# Altium project PCB_15122020_01BC.PrjPcb (part 2 of 9)

## Sheet USB_To_RS232.SchDoc
size A3 portrait
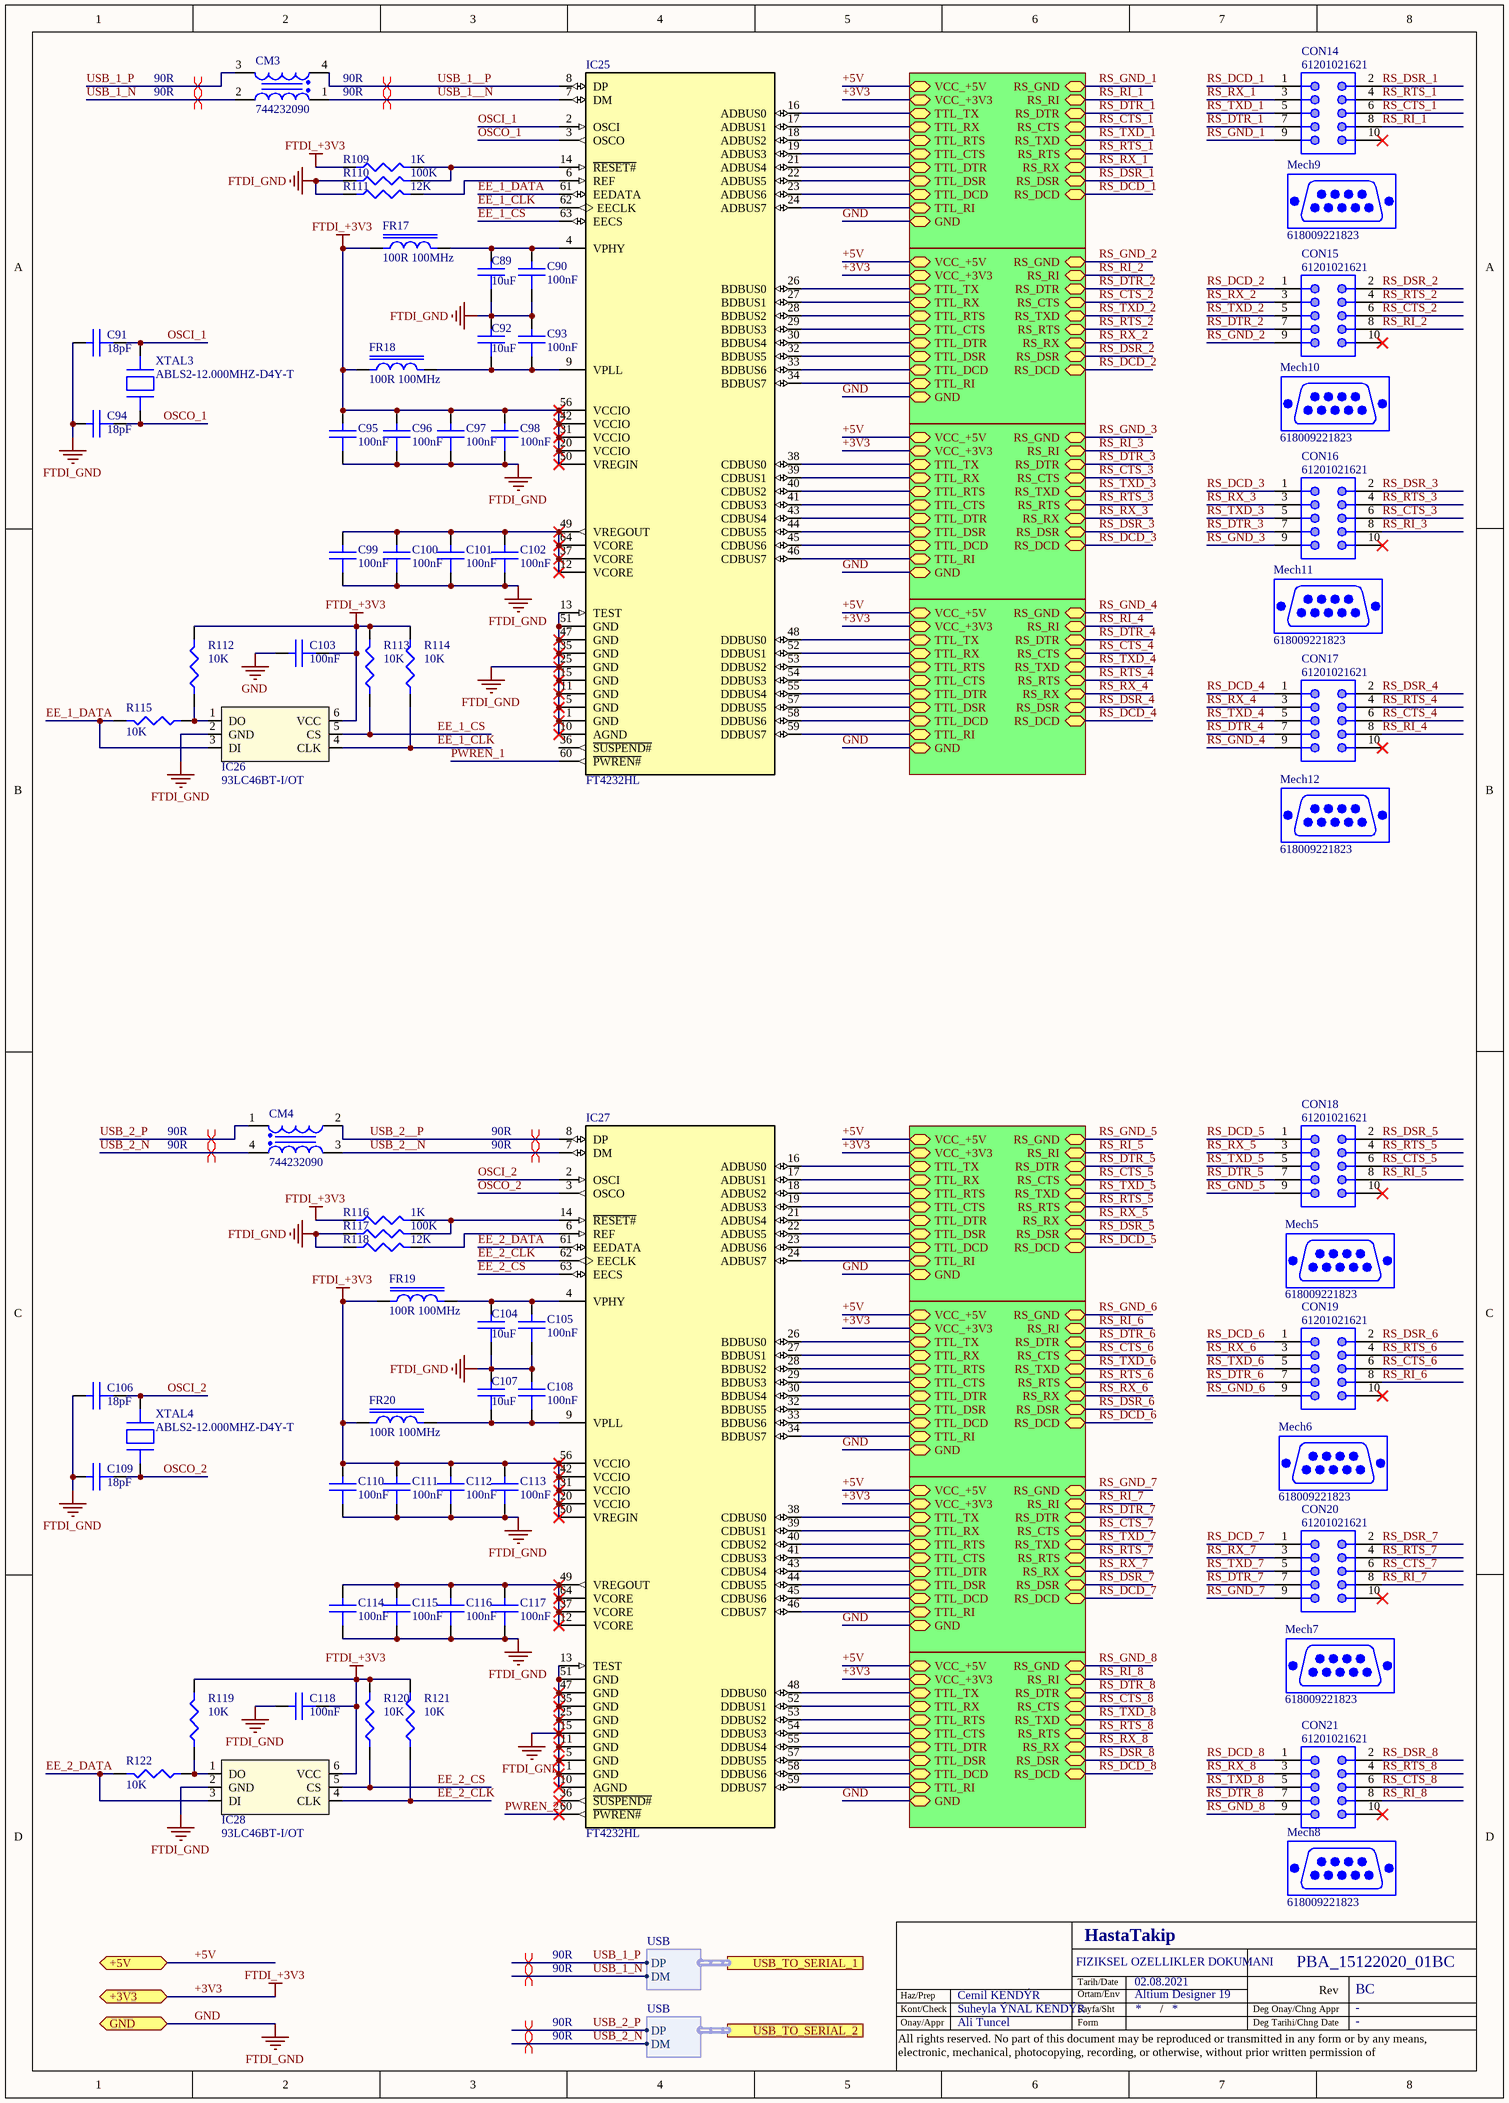
[diagram p1: USB_To_RS232.SchDoc]

### Parts
C89  10uF  [C0603]
C90  100nF  [C0603]
C91  18pF  [C0603]
C92  10uF  [C0603]
C93  100nF  [C0603]
C94  18pF  [C0603]
C95  100nF  [C0603]
C96  100nF  [C0603]
C97  100nF  [C0603]
C98  100nF  [C0603]
C99  100nF  [C0603]
C100  100nF  [C0603]
C101  100nF  [C0603]
C102  100nF  [C0603]
C103  100nF  [C0603]
C104  10uF  [C0603]
C105  100nF  [C0603]
C106  18pF  [C0603]
C107  10uF  [C0603]
C108  100nF  [C0603]
C109  18pF  [C0603]
C110  100nF  [C0603]
C111  100nF  [C0603]
C112  100nF  [C0603]
C113  100nF  [C0603]
C114  100nF  [C0603]
C115  100nF  [C0603]
C116  100nF  [C0603]
C117  100nF  [C0603]
C118  100nF  [C0603]
CM3  744232090  [WE-CNSW_1206]
CM4  744232090  [WE-CNSW_1206]
CON14  61201021621  [61201021621]
CON15  61201021621  [61201021621]
CON16  61201021621  [61201021621]
CON17  61201021621  [61201021621]
CON18  61201021621  [61201021621]
CON19  61201021621  [61201021621]
CON20  61201021621  [61201021621]
CON21  61201021621  [61201021621]
FR17  100R 100MHz  [FR_0603]
FR18  100R 100MHz  [FR_0603]
FR19  100R 100MHz  [FR_0603]
FR20  100R 100MHz  [FR_0603]
IC25  FT4232HL  [QFP50P1200X1200X160-64N]
IC26  93LC46BT-I/OT  [SOT 23-6]
IC27  FT4232HL  [QFP50P1200X1200X160-64N]
IC28  93LC46BT-I/OT  [SOT 23-6]
Mech5  618009221823  [618009221823]
Mech6  618009221823  [618009221823]
Mech7  618009221823  [618009221823]
Mech8  618009221823  [618009221823]
Mech9  618009221823  [618009221823]
Mech10  618009221823  [618009221823]
Mech11  618009221823  [618009221823]
Mech12  618009221823  [618009221823]
R109  1K  [R0603]
R110  100K  [R0603]
R111  12K  [R0603]
R112  10K  [R0603]
R113  10K  [R0603]
R114  10K  [R0603]
R115  10K  [R0603]
R116  1K  [R0603]
R117  100K  [R0603]
R118  12K  [R0603]
R119  10K  [R0603]
R120  10K  [R0603]
R121  10K  [R0603]
R122  10K  [R0603]
XTAL3  ABLS2-12.000MHZ-D4Y-T  [CrystalSMD]
XTAL4  ABLS2-12.000MHZ-D4Y-T  [CrystalSMD]

### Sub-sheets
RS232_1 = RS232.SchDoc: TTL_TX (bidir), TTL_RX (bidir), TTL_RTS (bidir), TTL_CTS (bidir), TTL_DTR (bidir), TTL_DSR (bidir), TTL_DCD (bidir), TTL_RI (bidir), RS_GND (bidir), RS_RI (bidir), RS_DTR (bidir), RS_CTS (bidir), RS_TXD (bidir), RS_RTS (bidir), RS_RX (bidir), RS_DSR (bidir), RS_DCD (bidir), VCC_+5V (bidir), GND (bidir), VCC_+3V3 (bidir)
RS232_2 = RS232.SchDoc: TTL_TX (bidir), TTL_RX (bidir), TTL_RTS (bidir), TTL_CTS (bidir), TTL_DTR (bidir), TTL_DSR (bidir), TTL_DCD (bidir), TTL_RI (bidir), RS_GND (bidir), RS_RI (bidir), RS_DTR (bidir), RS_CTS (bidir), RS_TXD (bidir), RS_RTS (bidir), RS_RX (bidir), RS_DSR (bidir), RS_DCD (bidir), VCC_+5V (bidir), GND (bidir), VCC_+3V3 (bidir)
RS232_3 = RS232.SchDoc: TTL_TX (bidir), TTL_RX (bidir), TTL_RTS (bidir), TTL_CTS (bidir), TTL_DTR (bidir), TTL_DSR (bidir), TTL_DCD (bidir), TTL_RI (bidir), RS_GND (bidir), RS_RI (bidir), RS_DTR (bidir), RS_CTS (bidir), RS_TXD (bidir), RS_RTS (bidir), RS_RX (bidir), RS_DSR (bidir), RS_DCD (bidir), VCC_+5V (bidir), GND (bidir), VCC_+3V3 (bidir)
RS232_4 = RS232.SchDoc: TTL_TX (bidir), TTL_RX (bidir), TTL_RTS (bidir), TTL_CTS (bidir), TTL_DTR (bidir), TTL_DSR (bidir), TTL_DCD (bidir), TTL_RI (bidir), RS_GND (bidir), RS_RI (bidir), RS_DTR (bidir), RS_CTS (bidir), RS_TXD (bidir), RS_RTS (bidir), RS_RX (bidir), RS_DSR (bidir), RS_DCD (bidir), VCC_+5V (bidir), GND (bidir), VCC_+3V3 (bidir)
RS232_5 = RS232.SchDoc: TTL_TX (bidir), TTL_RX (bidir), TTL_RTS (bidir), TTL_CTS (bidir), TTL_DTR (bidir), TTL_DSR (bidir), TTL_DCD (bidir), TTL_RI (bidir), RS_GND (bidir), RS_RI (bidir), RS_DTR (bidir), RS_CTS (bidir), RS_TXD (bidir), RS_RTS (bidir), RS_RX (bidir), RS_DSR (bidir), RS_DCD (bidir), VCC_+5V (bidir), GND (bidir), VCC_+3V3 (bidir)
RS232_6 = RS232.SchDoc: TTL_TX (bidir), TTL_RX (bidir), TTL_RTS (bidir), TTL_CTS (bidir), TTL_DTR (bidir), TTL_DSR (bidir), TTL_DCD (bidir), TTL_RI (bidir), RS_GND (bidir), RS_RI (bidir), RS_DTR (bidir), RS_CTS (bidir), RS_TXD (bidir), RS_RTS (bidir), RS_RX (bidir), RS_DSR (bidir), RS_DCD (bidir), VCC_+5V (bidir), GND (bidir), VCC_+3V3 (bidir)
RS232_7 = RS232.SchDoc: TTL_TX (bidir), TTL_RX (bidir), TTL_RTS (bidir), TTL_CTS (bidir), TTL_DTR (bidir), TTL_DSR (bidir), TTL_DCD (bidir), TTL_RI (bidir), RS_GND (bidir), RS_RI (bidir), RS_DTR (bidir), RS_CTS (bidir), RS_TXD (bidir), RS_RTS (bidir), RS_RX (bidir), RS_DSR (bidir), RS_DCD (bidir), VCC_+5V (bidir), GND (bidir), VCC_+3V3 (bidir)
RS232_8 = RS232.SchDoc: TTL_TX (bidir), TTL_RX (bidir), TTL_RTS (bidir), TTL_CTS (bidir), TTL_DTR (bidir), TTL_DSR (bidir), TTL_DCD (bidir), TTL_RI (bidir), RS_GND (bidir), RS_RI (bidir), RS_DTR (bidir), RS_CTS (bidir), RS_TXD (bidir), RS_RTS (bidir), RS_RX (bidir), RS_DSR (bidir), RS_DCD (bidir), VCC_+5V (bidir), GND (bidir), VCC_+3V3 (bidir)

### Ports
+3V3 (bidir), +5V (bidir), GND (bidir), USB_TO_SERIAL_1 (harness USB), USB_TO_SERIAL_2 (harness USB)

### Harnesses
USB: DP, DM

### Nets
+3V3: C95.1 C96.1 C97.1 C98.1 C103.2 C110.1 C111.1 C112.1 C113.1 C118.2 FR17.1 FR18.1 FR19.1 FR20.1 IC25.20(VCCIO) IC25.31(VCCIO) IC25.42(VCCIO) IC25.50(VREGIN) IC25.56(VCCIO) IC26.6(VCC) IC27.20(VCCIO) IC27.31(VCCIO) IC27.42(VCCIO) IC27.50(VREGIN) IC27.56(VCCIO) IC28.6(VCC) R109.1 R112.2 R113.2 R114.2 R116.1 R119.2 R120.2 R121.2 ; port +3V3, sheet RS232_1/VCC_+3V3, sheet RS232_2/VCC_+3V3, sheet RS232_3/VCC_+3V3, sheet RS232_4/VCC_+3V3, sheet RS232_5/VCC_+3V3, sheet RS232_6/VCC_+3V3, sheet RS232_7/VCC_+3V3, sheet RS232_8/VCC_+3V3  [also labelled FTDI_+3V3]
+5V: port +5V, sheet RS232_1/VCC_+5V, sheet RS232_2/VCC_+5V, sheet RS232_3/VCC_+5V, sheet RS232_4/VCC_+5V, sheet RS232_5/VCC_+5V, sheet RS232_6/VCC_+5V, sheet RS232_7/VCC_+5V, sheet RS232_8/VCC_+5V
GND: C89.2 C90.2 C91.1 C92.1 C93.1 C94.1 C95.2 C96.2 C97.2 C98.2 C99.2 C100.2 C101.2 C102.2 C103.1 C104.2 C105.2 C106.1 C107.1 C108.1 C109.1 C110.2 C111.2 C112.2 C113.2 C114.2 C115.2 C116.2 C117.2 C118.1 IC25.1(GND) IC25.5(GND) IC25.10(AGND) IC25.11(GND) IC25.13(TEST) IC25.15(GND) IC25.25(GND) IC25.35(GND) IC25.47(GND) IC25.51(GND) IC26.2(GND) IC27.1(GND) IC27.5(GND) IC27.10(AGND) IC27.11(GND) IC27.13(TEST) IC27.15(GND) IC27.25(GND) IC27.35(GND) IC27.47(GND) IC27.51(GND) IC28.2(GND) R110.1 R111.1 R117.1 R118.1 ; port GND, sheet RS232_1/GND, sheet RS232_2/GND, sheet RS232_3/GND, sheet RS232_4/GND, sheet RS232_5/GND, sheet RS232_6/GND, sheet RS232_7/GND, sheet RS232_8/GND  [also labelled FTDI_GND]
EE_1_CLK: IC25.62(EECLK) IC26.4(CLK) R114.1
EE_1_CS: IC25.63(EECS) IC26.5(CS) R113.1
EE_1_DATA: IC25.61(EEDATA) IC26.3(DI) R115.2
EE_2_CLK: IC27.62(EECLK) IC28.4(CLK) R121.1
EE_2_CS: IC27.63(EECS) IC28.5(CS) R120.1
EE_2_DATA: IC27.61(EEDATA) IC28.3(DI) R122.2
OSCI_1: C91.2 IC25.2(OSCI) XTAL3.2
OSCI_2: C106.2 IC27.2(OSCI) XTAL4.2
OSCO_1: C94.2 IC25.3(OSCO) XTAL3.1
OSCO_2: C109.2 IC27.3(OSCO) XTAL4.1
PWREN_1: IC25.60(~{PWREN#})
PWREN_2: IC27.60(~{PWREN#})
RS_CTS_1: CON14.6 ; sheet RS232_1/RS_CTS  [project net RS_CTS]
RS_CTS_2: CON15.6 ; sheet RS232_2/RS_CTS  [project net RS_CTS]
RS_CTS_3: CON16.6 ; sheet RS232_3/RS_CTS  [project net RS_CTS]
RS_CTS_4: CON17.6 ; sheet RS232_4/RS_CTS  [project net RS_CTS]
RS_CTS_5: CON18.6 ; sheet RS232_5/RS_CTS  [project net RS_CTS]
RS_CTS_6: CON19.6 ; sheet RS232_6/RS_CTS  [project net RS_CTS]
RS_CTS_7: CON20.6 ; sheet RS232_7/RS_CTS  [project net RS_CTS]
RS_CTS_8: CON21.6 ; sheet RS232_8/RS_CTS  [project net RS_CTS]
RS_DCD_1: CON14.1 ; sheet RS232_1/RS_DCD  [project net RS_DCD]
RS_DCD_2: CON15.1 ; sheet RS232_2/RS_DCD  [project net RS_DCD]
RS_DCD_3: CON16.1 ; sheet RS232_3/RS_DCD  [project net RS_DCD]
RS_DCD_4: CON17.1 ; sheet RS232_4/RS_DCD  [project net RS_DCD]
RS_DCD_5: CON18.1 ; sheet RS232_5/RS_DCD  [project net RS_DCD]
RS_DCD_6: CON19.1 ; sheet RS232_6/RS_DCD  [project net RS_DCD]
RS_DCD_7: CON20.1 ; sheet RS232_7/RS_DCD  [project net RS_DCD]
RS_DCD_8: CON21.1 ; sheet RS232_8/RS_DCD  [project net RS_DCD]
RS_DSR_1: CON14.2 ; sheet RS232_1/RS_DSR  [project net RS_DSR]
RS_DSR_2: CON15.2 ; sheet RS232_2/RS_DSR  [project net RS_DSR]
RS_DSR_3: CON16.2 ; sheet RS232_3/RS_DSR  [project net RS_DSR]
RS_DSR_4: CON17.2 ; sheet RS232_4/RS_DSR  [project net RS_DSR]
RS_DSR_5: CON18.2 ; sheet RS232_5/RS_DSR  [project net RS_DSR]
RS_DSR_6: CON19.2 ; sheet RS232_6/RS_DSR  [project net RS_DSR]
RS_DSR_7: CON20.2 ; sheet RS232_7/RS_DSR  [project net RS_DSR]
RS_DSR_8: CON21.2 ; sheet RS232_8/RS_DSR  [project net RS_DSR]
RS_DTR_1: CON14.7 ; sheet RS232_1/RS_DTR  [project net RS_DTR]
RS_DTR_2: CON15.7 ; sheet RS232_2/RS_DTR  [project net RS_DTR]
RS_DTR_3: CON16.7 ; sheet RS232_3/RS_DTR  [project net RS_DTR]
RS_DTR_4: CON17.7 ; sheet RS232_4/RS_DTR  [project net RS_DTR]
RS_DTR_5: CON18.7 ; sheet RS232_5/RS_DTR  [project net RS_DTR]
RS_DTR_6: CON19.7 ; sheet RS232_6/RS_DTR  [project net RS_DTR]
RS_DTR_7: CON20.7 ; sheet RS232_7/RS_DTR  [project net RS_DTR]
RS_DTR_8: CON21.7 ; sheet RS232_8/RS_DTR  [project net RS_DTR]
RS_GND_1: CON14.9 ; sheet RS232_1/RS_GND  [project net RS232_GND]
RS_GND_2: CON15.9 ; sheet RS232_2/RS_GND  [project net RS232_GND]
RS_GND_3: CON16.9 ; sheet RS232_3/RS_GND  [project net RS232_GND]
RS_GND_4: CON17.9 ; sheet RS232_4/RS_GND  [project net RS232_GND]
RS_GND_5: CON18.9 ; sheet RS232_5/RS_GND  [project net RS232_GND]
RS_GND_6: CON19.9 ; sheet RS232_6/RS_GND  [project net RS232_GND]
RS_GND_7: CON20.9 ; sheet RS232_7/RS_GND  [project net RS232_GND]
RS_GND_8: CON21.9 ; sheet RS232_8/RS_GND  [project net RS232_GND]
RS_RI_1: CON14.8 ; sheet RS232_1/RS_RI  [project net RS_RI]
RS_RI_2: CON15.8 ; sheet RS232_2/RS_RI  [project net RS_RI]
RS_RI_3: CON16.8 ; sheet RS232_3/RS_RI  [project net RS_RI]
RS_RI_4: CON17.8 ; sheet RS232_4/RS_RI  [project net RS_RI]
RS_RI_5: CON18.8 ; sheet RS232_5/RS_RI  [project net RS_RI]
RS_RI_6: CON19.8 ; sheet RS232_6/RS_RI  [project net RS_RI]
RS_RI_7: CON20.8 ; sheet RS232_7/RS_RI  [project net RS_RI]
RS_RI_8: CON21.8 ; sheet RS232_8/RS_RI  [project net RS_RI]
RS_RTS_1: CON14.4 ; sheet RS232_1/RS_RTS  [project net RS_RTS]
RS_RTS_2: CON15.4 ; sheet RS232_2/RS_RTS  [project net RS_RTS]
RS_RTS_3: CON16.4 ; sheet RS232_3/RS_RTS  [project net RS_RTS]
RS_RTS_4: CON17.4 ; sheet RS232_4/RS_RTS  [project net RS_RTS]
RS_RTS_5: CON18.4 ; sheet RS232_5/RS_RTS  [project net RS_RTS]
RS_RTS_6: CON19.4 ; sheet RS232_6/RS_RTS  [project net RS_RTS]
RS_RTS_7: CON20.4 ; sheet RS232_7/RS_RTS  [project net RS_RTS]
RS_RTS_8: CON21.4 ; sheet RS232_8/RS_RTS  [project net RS_RTS]
RS_RX_1: CON14.3 ; sheet RS232_1/RS_RX  [project net RS_RX]
RS_RX_2: CON15.3 ; sheet RS232_2/RS_RX  [project net RS_RX]
RS_RX_3: CON16.3 ; sheet RS232_3/RS_RX  [project net RS_RX]
RS_RX_4: CON17.3 ; sheet RS232_4/RS_RX  [project net RS_RX]
RS_RX_5: CON18.3 ; sheet RS232_5/RS_RX  [project net RS_RX]
RS_RX_6: CON19.3 ; sheet RS232_6/RS_RX  [project net RS_RX]
RS_RX_7: CON20.3 ; sheet RS232_7/RS_RX  [project net RS_RX]
RS_RX_8: CON21.3 ; sheet RS232_8/RS_RX  [project net RS_RX]
RS_TXD_1: CON14.5 ; sheet RS232_1/RS_TXD  [project net RS_TXD]
RS_TXD_2: CON15.5 ; sheet RS232_2/RS_TXD  [project net RS_TXD]
RS_TXD_3: CON16.5 ; sheet RS232_3/RS_TXD  [project net RS_TXD]
RS_TXD_4: CON17.5 ; sheet RS232_4/RS_TXD  [project net RS_TXD]
RS_TXD_5: CON18.5 ; sheet RS232_5/RS_TXD  [project net RS_TXD]
RS_TXD_6: CON19.5 ; sheet RS232_6/RS_TXD  [project net RS_TXD]
RS_TXD_7: CON20.5 ; sheet RS232_7/RS_TXD  [project net RS_TXD]
RS_TXD_8: CON21.5 ; sheet RS232_8/RS_TXD  [project net RS_TXD]
USB_1__N: CM3.1 IC25.7(DM)
USB_1__P: CM3.4 IC25.8(DP)
USB_1_N: CM3.2 ; port USB_TO_SERIAL_1.DM
USB_1_P: CM3.3 ; port USB_TO_SERIAL_1.DP
USB_2__N: CM4.3 IC27.7(DM)
USB_2__P: CM4.2 IC27.8(DP)
USB_2_N: CM4.4 ; port USB_TO_SERIAL_2.DM
USB_2_P: CM4.1 ; port USB_TO_SERIAL_2.DP
NetC89_1: C89.1 C90.1 FR17.2 IC25.4(VPHY)
NetC92_2: C92.2 C93.2 FR18.2 IC25.9(VPLL)
NetC99_1: C99.1 C100.1 C101.1 C102.1 IC25.12(VCORE) IC25.37(VCORE) IC25.49(VREGOUT) IC25.64(VCORE)
NetC104_1: C104.1 C105.1 FR19.2 IC27.4(VPHY)
NetC107_2: C107.2 C108.2 FR20.2 IC27.9(VPLL)
NetC114_1: C114.1 C115.1 C116.1 C117.1 IC27.12(VCORE) IC27.37(VCORE) IC27.49(VREGOUT) IC27.64(VCORE)
NetIC25_6: IC25.6(REF) R111.2
NetIC25_14: IC25.14(~{RESET#}) R109.2 R110.2
NetIC25_16: IC25.16(ADBUS0) ; sheet RS232_1/TTL_TX
NetIC25_17: IC25.17(ADBUS1) ; sheet RS232_1/TTL_RX
NetIC25_18: IC25.18(ADBUS2) ; sheet RS232_1/TTL_RTS
NetIC25_19: IC25.19(ADBUS3) ; sheet RS232_1/TTL_CTS
NetIC25_21: IC25.21(ADBUS4) ; sheet RS232_1/TTL_DTR
NetIC25_22: IC25.22(ADBUS5) ; sheet RS232_1/TTL_DSR
NetIC25_23: IC25.23(ADBUS6) ; sheet RS232_1/TTL_DCD
NetIC25_24: IC25.24(ADBUS7) ; sheet RS232_1/TTL_RI
NetIC25_26: IC25.26(BDBUS0) ; sheet RS232_2/TTL_TX
NetIC25_27: IC25.27(BDBUS1) ; sheet RS232_2/TTL_RX
NetIC25_28: IC25.28(BDBUS2) ; sheet RS232_2/TTL_RTS
NetIC25_29: IC25.29(BDBUS3) ; sheet RS232_2/TTL_CTS
NetIC25_30: IC25.30(BDBUS4) ; sheet RS232_2/TTL_DTR
NetIC25_32: IC25.32(BDBUS5) ; sheet RS232_2/TTL_DSR
NetIC25_33: IC25.33(BDBUS6) ; sheet RS232_2/TTL_DCD
NetIC25_34: IC25.34(BDBUS7) ; sheet RS232_2/TTL_RI
NetIC25_38: IC25.38(CDBUS0) ; sheet RS232_3/TTL_TX
NetIC25_39: IC25.39(CDBUS1) ; sheet RS232_3/TTL_RX
NetIC25_40: IC25.40(CDBUS2) ; sheet RS232_3/TTL_RTS
NetIC25_41: IC25.41(CDBUS3) ; sheet RS232_3/TTL_CTS
NetIC25_43: IC25.43(CDBUS4) ; sheet RS232_3/TTL_DTR
NetIC25_44: IC25.44(CDBUS5) ; sheet RS232_3/TTL_DSR
NetIC25_45: IC25.45(CDBUS6) ; sheet RS232_3/TTL_DCD
NetIC25_46: IC25.46(CDBUS7) ; sheet RS232_3/TTL_RI
NetIC25_48: IC25.48(DDBUS0) ; sheet RS232_4/TTL_TX
NetIC25_52: IC25.52(DDBUS1) ; sheet RS232_4/TTL_RX
NetIC25_53: IC25.53(DDBUS2) ; sheet RS232_4/TTL_RTS
NetIC25_54: IC25.54(DDBUS3) ; sheet RS232_4/TTL_CTS
NetIC25_55: IC25.55(DDBUS4) ; sheet RS232_4/TTL_DTR
NetIC25_57: IC25.57(DDBUS5) ; sheet RS232_4/TTL_DSR
NetIC25_58: IC25.58(DDBUS6) ; sheet RS232_4/TTL_DCD
NetIC25_59: IC25.59(DDBUS7) ; sheet RS232_4/TTL_RI
NetIC26_1: IC26.1(DO) R112.1 R115.1
NetIC27_6: IC27.6(REF) R118.2
NetIC27_14: IC27.14(~{RESET#}) R116.2 R117.2
NetIC27_16: IC27.16(ADBUS0) ; sheet RS232_5/TTL_TX
NetIC27_17: IC27.17(ADBUS1) ; sheet RS232_5/TTL_RX
NetIC27_18: IC27.18(ADBUS2) ; sheet RS232_5/TTL_RTS
NetIC27_19: IC27.19(ADBUS3) ; sheet RS232_5/TTL_CTS
NetIC27_21: IC27.21(ADBUS4) ; sheet RS232_5/TTL_DTR
NetIC27_22: IC27.22(ADBUS5) ; sheet RS232_5/TTL_DSR
NetIC27_23: IC27.23(ADBUS6) ; sheet RS232_5/TTL_DCD
NetIC27_24: IC27.24(ADBUS7) ; sheet RS232_5/TTL_RI
NetIC27_26: IC27.26(BDBUS0) ; sheet RS232_6/TTL_TX
NetIC27_27: IC27.27(BDBUS1) ; sheet RS232_6/TTL_RX
NetIC27_28: IC27.28(BDBUS2) ; sheet RS232_6/TTL_RTS
NetIC27_29: IC27.29(BDBUS3) ; sheet RS232_6/TTL_CTS
NetIC27_30: IC27.30(BDBUS4) ; sheet RS232_6/TTL_DTR
NetIC27_32: IC27.32(BDBUS5) ; sheet RS232_6/TTL_DSR
NetIC27_33: IC27.33(BDBUS6) ; sheet RS232_6/TTL_DCD
NetIC27_34: IC27.34(BDBUS7) ; sheet RS232_6/TTL_RI
NetIC27_38: IC27.38(CDBUS0) ; sheet RS232_7/TTL_TX
NetIC27_39: IC27.39(CDBUS1) ; sheet RS232_7/TTL_RX
NetIC27_40: IC27.40(CDBUS2) ; sheet RS232_7/TTL_RTS
NetIC27_41: IC27.41(CDBUS3) ; sheet RS232_7/TTL_CTS
NetIC27_43: IC27.43(CDBUS4) ; sheet RS232_7/TTL_DTR
NetIC27_44: IC27.44(CDBUS5) ; sheet RS232_7/TTL_DSR
NetIC27_45: IC27.45(CDBUS6) ; sheet RS232_7/TTL_DCD
NetIC27_46: IC27.46(CDBUS7) ; sheet RS232_7/TTL_RI
NetIC27_48: IC27.48(DDBUS0) ; sheet RS232_8/TTL_TX
NetIC27_52: IC27.52(DDBUS1) ; sheet RS232_8/TTL_RX
NetIC27_53: IC27.53(DDBUS2) ; sheet RS232_8/TTL_RTS
NetIC27_54: IC27.54(DDBUS3) ; sheet RS232_8/TTL_CTS
NetIC27_55: IC27.55(DDBUS4) ; sheet RS232_8/TTL_DTR
NetIC27_57: IC27.57(DDBUS5) ; sheet RS232_8/TTL_DSR
NetIC27_58: IC27.58(DDBUS6) ; sheet RS232_8/TTL_DCD
NetIC27_59: IC27.59(DDBUS7) ; sheet RS232_8/TTL_RI
NetIC28_1: IC28.1(DO) R119.1 R122.1

Not connected (* = marked no-connect by the designer): CON14 10*; CON15 10*; CON16 10*; CON17 10*; CON18 10*; CON19 10*; CON20 10*; CON21 10*; IC25 36(~{SUSPEND#}); IC27 36(~{SUSPEND#})*

### Layout directives
differential pair; differential pair class 90R: USB_1__N, USB_1__P, USB_1_N, USB_1_P, USB_2__N, USB_2__P, USB_2_N, USB_2_P

### Notes on the sheet
- Tarih/Date
- Haz/Prep
- Kont/Check
- Onay/Appr
- Sayfa/Sht
- Form
- Ortam/Env
- /
- Deg Tarihi/Chng Date
- Deg Onay/Chng Appr
- Rev
- All rights reserved. No part of this document may be reproduced or transmitted in any form or by any means, electronic, mechanical, photocopying, recording, or otherwise, without prior written permission of

### Library data of the parts
C89 C92 C104 C107 = CC0603MRX5R6BB106: 10uF 10V X5R 20% SMD 0603 85C Paper T/R; Manufacturer: Yageo; Supplier 1: Digi-Key; Supplier Part Number 1: 311-1817-1-ND; Manufacturer Part Number: CC0603MRX5R6BB106; Stock 1: 209492; Pricing 1: 1 = 0,20000, 10 = 0,13700, 50 = 0,08200, 100 = 0,06920, 500 = 0,04736, 1000 = 0,04190 (USD); RoHS: Yes; Mount: Surface Mount; Case/Package: 0603; Case Code (Imperial): 0603; Case Code (Metric): 1608; Weight: 7.1E-05oz; Min Operating Temperature: -55°C; Max Operating Temperature: 85°C; Voltage Rating: 10V; Termination: SMD/SMT; Resistor Type: Ceramic; Dielectric: X5R; Tolerance: 20%; Packaging: Tape and Reel; Capacitance: 10uF; Voltage Rating (DC): 10V; Length: 0.063inch; Width: 0.031inch; Thickness: 0.035inch; Depth: 0.8mm; Lead Free: Lead Free; Halogen Free: Halogen Free; ComponentLink1URL: http://components.arrow.com/part/dataview/0323_03079270?src-supplier=Arrow+Europe; ComponentLink1Description: http://components.arrow.com/part/dataview/0323_03079270?src-supplier=Arrow+Europe; ComponentLink2URL: http://www.mouser.com/ds/2/447/UPY-GPHC_X5R_4V-to-50V_25-1131599.pdf?src-supplier=Mouser; ComponentLink2Description: http://www.mouser.com/ds/2/447/UPY-GPHC_X5R_4V-to-50V_25-1131599.pdf?src-supplier=Mouser; ComponentLink3URL: http://www.yageo.com/documents/recent/UPY-GPHC_X5R_4V-to-50V_25.pdf?src-supplier=Digi-Key; ComponentLink3Description: http://www.yageo.com/documents/recent/UPY-GPHC_X5R_4V-to-50V_25.pdf?src-supplier=Digi-Key; Category: Capasitor
C90 C93 C95-C103 C105 C108 C110-C118 = CC0603KRX7R8BB104: 100nF, 25V, X7R, 10%, 0603; Manufacturer: Yageo; Supplier 1: Digi-Key; Supplier Part Number 1: 311-1341-1-ND; Manufacturer Part Number: CC0603KRX7R8BB104; Stock 1: 10150433; Pricing 1: 1 = 0,10000, 10 = 0,04500, 50 = 0,02480, 100 = 0,02020, 500 = 0,01444, 1000 = 0,01134 (USD); RoHS: Yes; Mount: Surface Mount; Case/Package: 0603; Number of Pins: 2; Case Code (Imperial): 0603; Case Code (Metric): 1608; Min Operating Temperature: -55°C; Max Operating Temperature: 125°C; Capacitance: 100nF; Tolerance: 10%; Voltage Rating: 25V; Packaging: Tape and Reel; Package Quantity: 1; Voltage Rating (DC): 25V; Dielectric: X7R; Termination: SMD/SMT; Resistor Type: Ceramic; Voltage: 25V; Length: 1.6mm; Width: 0.8mm; Height: 0.8mm; Thickness: 0.035inch; Depth: 0.8mm; Radiation Hardening: No; REACH SVHC: Unknown; Lead Free: Lead Free; Halogen Free: Halogen Free; ComponentLink1URL: https://datasheet.ciiva.com/11786/0900766b80c10176-11786120.pdf?src-supplier=RSComponents; ComponentLink1Description: https://datasheet.ciiva.com/11786/0900766b80c10176-11786120.pdf?src-supplier=RSComponents; ComponentLink2URL: https://datasheet.ciiva.com/144/mlccorderingcode-144075.pdf?src-supplier=Digi-Key; ComponentLink2Description: https://datasheet.ciiva.com/144/mlccorderingcode-144075.pdf?src-supplier=Digi-Key; ComponentLink3URL: https://datasheet.ciiva.com/17434/upy-gphc-x7r-6-3v-to-50v-8-17434263.pdf?src-supplier=Avnet+Europe; ComponentLink3Description: https://datasheet.ciiva.com/17434/upy-gphc-x7r-6-3v-to-50v-8-17434263.pdf?src-supplier=Avnet+Europe; ComponentLink4URL: https://datasheet.ciiva.com/26829/getdatasheetpartid-403577-26829431.pdf?src-supplier=Verical; ComponentLink4Description: https://datasheet.ciiva.com/26829/getdatasheetpartid-403577-26829431.pdf?src-supplier=Verical; ComponentLink5URL: https://datasheet.ciiva.com/11587/upy-gphc-x7r-6-3v-to-50v-8-11587208.pdf?src-supplier=Avnet; ComponentLink5Description: https://datasheet.ciiva.com/11587/upy-gphc-x7r-6-3v-to-50v-8-11587208.pdf?src-supplier=Avnet; ComponentLink6URL: https://datasheet.ciiva.com/13389/upy-gphc-x7r-6-3v-to-50v-8-13389352.pdf?src-supplier=Mouser; ComponentLink6Description: https://datasheet.ciiva.com/13389/upy-gphc-x7r-6-3v-to-50v-8-13389352.pdf?src-supplier=Mouser; ComponentLink7URL: https://datasheet.ciiva.com/28450/1489800-28450584.pdf?src-supplier=Element14; ComponentLink7Description: https://datasheet.ciiva.com/28450/1489800-28450584.pdf?src-supplier=Element14; ComponentLink8URL: https://datasheet.ciiva.com/144/mlccorderingcode-144073.pdf?src-supplier=Digi-Key; ComponentLink8Description: https://datasheet.ciiva.com/144/mlccorderingcode-144073.pdf?src-supplier=Digi-Key; ComponentLink9URL: https://datasheet.ciiva.com/144/mlccorderingcode-144074.pdf?src-supplier=Digi-Key; ComponentLink9Description: https://datasheet.ciiva.com/144/mlccorderingcode-144074.pdf?src-supplier=Digi-Key; ComponentLink10URL: https://datasheet.ciiva.com/7978/1489800-7978155.pdf?src-supplier=Element14; ComponentLink10Description: https://datasheet.ciiva.com/7978/1489800-7978155.pdf?src-supplier=Element14; Category: Capasitor
C91 C94 C106 C109 = CC0603JRNPO9BN180: 18 pF, 50 V, 0603 ± 5%, C0G / NP0; Manufacturer: Yageo; Voltage Rating: 50V; Temperature Coefficient: 30ppm/°C; Insulation Resistance: 100GR; Supplier 1: Digi-Key; Supplier Part Number 1: 311-1061-1-ND; Manufacturer Part Number: CC0603JRNPO9BN180; Stock 1: 27569; Pricing 1: 1 = 0,10000, 10 = 0,04100, 50 = 0,02220, 100 = 0,01810, 500 = 0,01294, 1000 = 0,01016 (USD); RoHS: Yes; Mount: Surface Mount; Case/Package: 0603; Number of Pins: 2; Case Code (Metric): 1608; Case Code (Imperial): 0603; Min Operating Temperature: -55°C; Max Operating Temperature: 125°C; Capacitance: 18pF; Tolerance: 5%; Packaging: Tape and Reel; Voltage Rating (DC): 50V; Package Quantity: 1; Dielectric: C0G; Termination: SMD/SMT; Resistor Type: Ceramic; Length: 1.6mm; Width: 0.031inch; Height: 0.8mm; Thickness: 0.035inch; Depth: 0.8mm; Radiation Hardening: No; REACH SVHC: No SVHC; Lead Free: Lead Free; ComponentLink1URL: https://datasheet.ciiva.com/144/mlccorderingcode-144637.pdf?src-supplier=Digi-Key; ComponentLink1Description: https://datasheet.ciiva.com/144/mlccorderingcode-144637.pdf?src-supplier=Digi-Key; ComponentLink2URL: https://datasheet.ciiva.com/144/mlccorderingcode-144638.pdf?src-supplier=Digi-Key; ComponentLink2Description: https://datasheet.ciiva.com/144/mlccorderingcode-144638.pdf?src-supplier=Digi-Key; ComponentLink3URL: https://datasheet.ciiva.com/144/mlccorderingcode-144639.pdf?src-supplier=Digi-Key; ComponentLink3Description: https://datasheet.ciiva.com/144/mlccorderingcode-144639.pdf?src-supplier=Digi-Key; ComponentLink4URL: https://datasheet.ciiva.com/8033/1734582-8033733.pdf?src-supplier=Element14; ComponentLink4Description: https://datasheet.ciiva.com/8033/1734582-8033733.pdf?src-supplier=Element14; ComponentLink5URL: https://datasheet.ciiva.com/46430/1835847-46430152.pdf?src-supplier=Element14; ComponentLink5Description: https://datasheet.ciiva.com/46430/1835847-46430152.pdf?src-supplier=Element14; ComponentLink6URL: https://datasheet.ciiva.com/11587/upy-gp-np0-16v-to-50v-8-11587323.pdf?src-supplier=Avnet; ComponentLink6Description: https://datasheet.ciiva.com/11587/upy-gp-np0-16v-to-50v-8-11587323.pdf?src-supplier=Avnet; ComponentLink7URL: https://datasheet.ciiva.com/16625/upy-gp-np0-16v-to-50v-8-16625517.pdf?src-supplier=Avnet+Europe; ComponentLink7Description: https://datasheet.ciiva.com/16625/upy-gp-np0-16v-to-50v-8-16625517.pdf?src-supplier=Avnet+Europe; ComponentLink8URL: https://datasheet.ciiva.com/28450/1443161-28450477.pdf?src-supplier=Element14; ComponentLink8Description: https://datasheet.ciiva.com/28450/1443161-28450477.pdf?src-supplier=Element14; ComponentLink9URL: https://datasheet.ciiva.com/5425/upy-gp-np0-16v-to-50v-8-5425439.pdf?src-supplier=Mouser; ComponentLink9Description: https://datasheet.ciiva.com/5425/upy-gp-np0-16v-to-50v-8-5425439.pdf?src-supplier=Mouser; Category: Capasitor
CM3 CM4 = 744232090: Common Mode Chokes Dual 90Ohm 100MHz 370mA SMD T/R; Manufacturer: Wurth Electronics; Core Material: Ferrite; Number of Lines: 2; Tolerance: 25%; Voltage Rating: 50V; Resistance: 300mR; Inductance: 3.3H; Impedance: 90R; Supplier 1: Digi-Key; Supplier Part Number 1: 732-1469-1-ND; Manufacturer Part Number: 744232090; Stock 1: 24452; Pricing 1: 1 = 1,23000, 10 = 1,17600, 50 = 1,09800, 100 = 1,03900, 500 = 1,00000, 1000 = 0,82300 (USD); RoHS: Yes; Mount: Surface Mount; Case/Package: 1206; Weight: 0.001376oz; Min Operating Temperature: -40°C; Max Operating Temperature: 125°C; Package Quantity: 1; Packaging: Tape and Reel; Frequency: 100MHz; Current Rating: 370mA; Voltage Rating (DC): 50V; Max Current Rating: 370mA; Current: 370mA; DC Resistance (DCR): 300mR; Max DC Current: 370mA; Termination: SMD/SMT; Test Frequency: 100MHz; Length: 3.2mm; Width: 1.6mm; Height: 0.083inch; Depth: 1.6mm; REACH SVHC: No SVHC; Lead Free: Lead Free; ComponentLink1URL: https://datasheet.ciiva.com/1008/744232090-1008352.pdf?src-supplier=Digi-Key; ComponentLink1Description: https://datasheet.ciiva.com/1008/744232090-1008352.pdf?src-supplier=Digi-Key; ComponentLink2URL: https://datasheet.ciiva.com/4952/744232090-24424-4952291.pdf?src-supplier=Mouser; ComponentLink2Description: https://datasheet.ciiva.com/4952/744232090-24424-4952291.pdf?src-supplier=Mouser; ComponentLink3URL: https://datasheet.ciiva.com/1467/1735620-1467976.pdf?src-supplier=Element14; ComponentLink3Description: https://datasheet.ciiva.com/1467/1735620-1467976.pdf?src-supplier=Element14; ComponentLink4URL: https://datasheet.ciiva.com/11800/0900766b80595ce5-11800284.pdf?src-supplier=RSComponents; ComponentLink4Description: https://datasheet.ciiva.com/11800/0900766b80595ce5-11800284.pdf?src-supplier=RSComponents; ComponentLink5URL: https://datasheet.ciiva.com/14187/744232090-eng-tds-14187245.pdf?src-supplier=Distrelec; ComponentLink5Description: https://datasheet.ciiva.com/14187/744232090-eng-tds-14187245.pdf?src-supplier=Distrelec; Category: Filters Common Mode Chokes
CON14-CON21 = 61201021621: WURTH ELEKTRONIK - 61201021621 - Pin Header, Wire-to-Board, 2.54 mm, 2 Rows, 10 Contacts, Through Hole Straight, WR-BHD Series; Manufacturer: Wurth Electronics; Current Rating: 3A; Voltage Rating: 250V; Number of Positions: 10; Insulation Resistance: 1GR; Gender: Male; Connector Type: Male Pin; Pitch: 2.54mm; Row Spacing: 0.1inch; Supplier 1: Digi-Key; Supplier Part Number 1: 732-2094-ND; Manufacturer Part Number: 61201021621; Stock 1: 15759; Pricing 1: 1 = 0,45000, 10 = 0,43700, 50 = 0,40300, 100 = 0,36100, 260 = 0,31900, 520 = 0,31100 (USD); RoHS: Yes; Mount: Through Hole; Color: Black; Contact Material: Copper Alloy,Copper; Contact Plating: Gold; Housing Material: PBT; Min Operating Temperature: -40°C; Max Operating Temperature: 125°C; Package Quantity: 260; Number of Rows: 2; Packaging: Tray; Contact Gender: Male; Termination: Solder; Number of Contacts: 10; Orientation: Straight; Length: 9.1mm; Width: 20.36mm; Height: 8.85mm; REACH SVHC: Unknown; Lead Free: Lead Free; Flammability Rating: UL94 V-0; ComponentLink1URL: https://datasheet.ciiva.com/731/6120xx21621-731344.pdf?src-supplier=Digi-Key; ComponentLink1Description: https://datasheet.ciiva.com/731/6120xx21621-731344.pdf?src-supplier=Digi-Key; ComponentLink2URL: https://datasheet.ciiva.com/15395/6120xx21621-265834-15395106.pdf?src-supplier=Mouser; ComponentLink2Description: https://datasheet.ciiva.com/15395/6120xx21621-265834-15395106.pdf?src-supplier=Mouser; ComponentLink3URL: https://datasheet.ciiva.com/7648/76595-7648121.pdf?src-supplier=Element14; ComponentLink3Description: https://datasheet.ciiva.com/7648/76595-7648121.pdf?src-supplier=Element14; Category: Connectors, Interconnects Rectangular Connectors - Headers, Male Pins
FR17-FR20 = 742792620: 100Ohm 100MHz 500mA 0603 SMD; Manufacturer: Wurth Electronics; Tolerance: 25%; Resistance: 150mR; Number of Lines: 1; Supplier 1: Digi-Key; Supplier Part Number 1: 732-1579-1-ND; Manufacturer Part Number: 742792620; Stock 1: 4265; Pricing 1: 1 = 0,14000, 50 = 0,14000, 100 = 0,12900, 500 = 0,12300, 1000 = 0,11800, 2000 = 0,11200 (USD); RoHS: Yes; Mount: Surface Mount; Case/Package: SMD/SMT; Number of Pins: 2; Weight: 0.000141oz; Case Code (Metric): 1608; Case Code (Imperial): 0603; Material: Ferrite; Min Operating Temperature: -55°C; Max Operating Temperature: 125°C; Package Quantity: 1; Current Rating: 500mA; Packaging: Tape and Reel; Impedance: 100R; Max Current Rating: 500mA; DC Resistance (DCR): 150mR; Max DC Current: 500mA; Termination: SMD/SMT; Test Frequency: 100MHz; Length: 1.6mm; Width: 0.8mm; Height: 0.8mm; Depth: 0.8mm; REACH SVHC: Unknown; Lead Free: Lead Free; ComponentLink1URL: https://datasheet.ciiva.com/1013/742792620-1013392.pdf?src-supplier=Digi-Key; ComponentLink1Description: https://datasheet.ciiva.com/1013/742792620-1013392.pdf?src-supplier=Digi-Key; ComponentLink2URL: https://datasheet.ciiva.com/30489/0900766b812a674b-30489152.pdf?src-supplier=RSComponents; ComponentLink2Description: https://datasheet.ciiva.com/30489/0900766b812a674b-30489152.pdf?src-supplier=RSComponents; ComponentLink3URL: https://datasheet.ciiva.com/23762/742792620-23762994.pdf?src-supplier=Newark; ComponentLink3Description: https://datasheet.ciiva.com/23762/742792620-23762994.pdf?src-supplier=Newark; ComponentLink4URL: https://datasheet.ciiva.com/22711/530503-22711411.pdf?src-supplier=Element14; ComponentLink4Description: https://datasheet.ciiva.com/22711/530503-22711411.pdf?src-supplier=Element14; ComponentLink5URL: https://datasheet.ciiva.com/4940/742792620-81075-4940413.pdf?src-supplier=Mouser; ComponentLink5Description: https://datasheet.ciiva.com/4940/742792620-81075-4940413.pdf?src-supplier=Mouser; ComponentLink6URL: https://datasheet.ciiva.com/1013/742792620-1013393.pdf?src-supplier=Digi-Key; ComponentLink6Description: https://datasheet.ciiva.com/1013/742792620-1013393.pdf?src-supplier=Digi-Key; ComponentLink7URL: https://datasheet.ciiva.com/1013/742792620-1013394.pdf?src-supplier=Digi-Key; ComponentLink7Description: https://datasheet.ciiva.com/1013/742792620-1013394.pdf?src-supplier=Digi-Key; ComponentLink8URL: https://datasheet.ciiva.com/1466/530503-1466423.pdf?src-supplier=Element14; ComponentLink8Description: https://datasheet.ciiva.com/1466/530503-1466423.pdf?src-supplier=Element14; ComponentLink9URL: https://datasheet.ciiva.com/48698/001087044-da-01-ml-we-cbf-smd-ferrit-742792620-de-en-48698348.pdf?src-supplier=Conrad; ComponentLink9Description: https://datasheet.ciiva.com/48698/001087044-da-01-ml-we-cbf-smd-ferrit-742792620-de-en-48698348.pdf?src-supplier=Conrad; Category: Filters - Ferrite Beads and Chips
IC25 IC27 = FT4232HL-TRAY: IC USB HS QUAD UART/SYNC 64-LQFP; Manufacturer: FTDI; Number of Channels: 1; Max Supply Voltage: 3.63V; Min Supply Voltage: 1.62V; Interface: UART; Operating Supply Current: 70mA; Operating Supply Voltage: 3.3V; Supplier 1: Digi-Key; Manufacturer Part Number: FT4232HL-TRAY; Stock 1: 1575; Pricing 1: 1 = 8,30000, 10 = 8,09000, 50 = 7,46000, 100 = 7,14000, 500 = 6,88002, 1000 = 6,08000, 2500 = 5,28299 (USD); RoHS: Yes; Mount: Surface Mount; Case/Package: LQFP; Number of Pins: 64; Min Operating Temperature: -40°C; Max Operating Temperature: 85°C; Packaging: Tray; Package Quantity: 160; Radiation Hardening: No; ComponentLink1URL: https://datasheet.ciiva.com/26852/getdatasheetpartid-653404-26852859.pdf?src-supplier=Verical; ComponentLink1Description: https://datasheet.ciiva.com/26852/getdatasheetpartid-653404-26852859.pdf?src-supplier=Verical; ComponentLink2URL: https://datasheet.ciiva.com/26841/ft4232hl-tray-26841239.pdf?src-supplier=IIIC; ComponentLink2Description: https://datasheet.ciiva.com/26841/ft4232hl-tray-26841239.pdf?src-supplier=IIIC; ComponentLink3URL: https://datasheet.ciiva.com/1787/ds-ft4232h-1787139.pdf?src-supplier=Digi-Key; ComponentLink3Description: https://datasheet.ciiva.com/1787/ds-ft4232h-1787139.pdf?src-supplier=Digi-Key; Supplier Part Number 1: 768-1309-ND; Category: Integrated Circuits - Interface - Controllers
IC26 IC28 = 93LC46BT-I/OT: MICROCHIP - 93LC46BT-I/OT - EEPROM, Microwire, 1 Kbit, 64 x 16bit, Serial Microwire, 3 MHz, SOT-23, 6 Pins; Density: 1Kb; Max Supply Voltage: 5.5V; Min Supply Voltage: 2.5V; Access Time: 250ns; Frequency: 2MHz; Nominal Supply Current: 2mA; Supplier 1: Digi-Key; Supplier Part Number 1: 93LC46BT-I/OTCT-ND; Manufacturer: Microchip; Manufacturer Part Number: 93LC46BT-I/OT; Stock 1: 3299; Pricing 1: 1 = 0,20000, 100 = 0,19000 (USD); RoHS: Yes; Mount: Surface Mount; Case/Package: SOT-23; Number of Pins: 6; Contact Plating: Tin,Matte; Min Operating Temperature: -40°C; Max Operating Temperature: 85°C; Packaging: Tape and Reel; Package Quantity: 3000; Interface: Serial; Memory Type: EEPROM; Memory Size: 1Kb; Termination: SMD/SMT; Max Frequency: 2MHz; Length: 3.1mm; Width: 1.8mm; Height: 1.3mm; Radiation Hardening: No; REACH SVHC: No SVHC; Lead Free: Lead Free; ComponentLink1URL: https://datasheet.ciiva.com/1903/21749j-1903248.pdf?src-supplier=Digi-Key; ComponentLink1Description: https://datasheet.ciiva.com/1903/21749j-1903248.pdf?src-supplier=Digi-Key; ComponentLink2URL: https://datasheet.ciiva.com/41455/001085450-da-01-en-ic-eeprom-1kb-93lc46bt-i-ot-sot-23-6-mcp-41455225.pdf?src-supplier=Conrad; ComponentLink2Description: https://datasheet.ciiva.com/41455/001085450-da-01-en-ic-eeprom-1kb-93lc46bt-i-ot-sot-23-6-mcp-41455225.pdf?src-supplier=Conrad; ComponentLink3URL: https://datasheet.ciiva.com/1155/1688094-1155913.pdf?src-supplier=Element14; ComponentLink3Description: https://datasheet.ciiva.com/1155/1688094-1155913.pdf?src-supplier=Element14; ComponentLink4URL: https://datasheet.ciiva.com/22715/664718-22715194.pdf?src-supplier=Element14; ComponentLink4Description: https://datasheet.ciiva.com/22715/664718-22715194.pdf?src-supplier=Element14; ComponentLink5URL: https://datasheet.ciiva.com/9280/21749j-9280764.pdf?src-supplier=Avnet; ComponentLink5Description: https://datasheet.ciiva.com/9280/21749j-9280764.pdf?src-supplier=Avnet; ComponentLink6URL: https://datasheet.ciiva.com/14134/93lc46-abc-eng-tds-14134797.pdf?src-supplier=Distrelec; ComponentLink6Description: https://datasheet.ciiva.com/14134/93lc46-abc-eng-tds-14134797.pdf?src-supplier=Distrelec; ComponentLink7URL: https://datasheet.ciiva.com/16387/filehandler-aspxddocname-en550232-16387837.pdf?src-supplier=Future+Electronics; ComponentLink7Description: https://datasheet.ciiva.com/16387/filehandler-aspxddocname-en550232-16387837.pdf?src-supplier=Future+Electronics; Category: Integrated Circuits (ICs) - Memory
Mech5-Mech12 = 618009221823: D-sub Conn, Plug, 9POS, Idc; Manufacturer: Würth Elektronik; Supplier 1: Digi-Key; Supplier Part Number 1: 732-618009221823-ND; Manufacturer Part Number: 618009221823; Stock 1: 124; Pricing 1: 1 = 5,24000, 10 = 4,96900, 50 = 4,41300, 100 = 3,85000, 250 = 3,30200, 500 = 2,94200 (USD); ComponentLink1URL: http://datasheet.octopart.com/618009221823-W%C3%BCrth-Elektronik-datasheet-149524359.pdf?src-supplier=Farnell; ComponentLink1Description: http://datasheet.octopart.com/618009221823-W%C3%BCrth-Elektronik-datasheet-149524359.pdf?src-supplier=Farnell; Category: Connector
R109 R116 = RC0603FR-071KL: 1K OHM 1% 1/10W 0603; Manufacturer: Yageo; Resistance: 1kR; Temperature Coefficient: 100ppm/°C; Power Rating: 100mW; Voltage Rating: 50V; Supplier 1: Digi-Key; Supplier Part Number 1: 311-1.00KHRCT-ND; Manufacturer Part Number: RC0603FR-071KL; Stock 1: 29851447; Pricing 1: 1 = 0,10000, 10 = 0,02100, 100 = 0,00840, 1000 = 0,00379, 2500 = 0,00329 (USD); RoHS: Yes; Case/Package: 0603; Contact Plating: Tin,Matte; Case Code (Imperial): 0603; Case Code (Metric): 1608; Min Operating Temperature: -55°C; Max Operating Temperature: 155°C; Tolerance: 1%; Packaging: Tape and Reel; Resistor Type: Thick Film; Termination: SMD/SMT; Length: 1.6mm; Height: 0.45mm; Depth: 0.8mm; Radiation Hardening: No; REACH SVHC: No SVHC; Lead Free: Lead Free; Military Standard: Not; ComponentLink1URL: https://datasheet.ciiva.com/11808/0900766b80f96399-11808081.pdf?src-supplier=RSComponents; ComponentLink1Description: https://datasheet.ciiva.com/11808/0900766b80f96399-11808081.pdf?src-supplier=RSComponents; ComponentLink2URL: https://datasheet.ciiva.com/25906/pyu-rc0603-51-rohs-l-4-25906933.pdf?src-supplier=Avnet+Europe; ComponentLink2Description: https://datasheet.ciiva.com/25906/pyu-rc0603-51-rohs-l-4-25906933.pdf?src-supplier=Avnet+Europe; ComponentLink3URL: https://datasheet.ciiva.com/7660/1868787-7660790.pdf?src-supplier=Element14; ComponentLink3Description: https://datasheet.ciiva.com/7660/1868787-7660790.pdf?src-supplier=Element14; ComponentLink4URL: https://datasheet.ciiva.com/7746/1738695-7746279.pdf?src-supplier=Element14; ComponentLink4Description: https://datasheet.ciiva.com/7746/1738695-7746279.pdf?src-supplier=Element14; ComponentLink5URL: https://datasheet.ciiva.com/7746/1686128-7746280.pdf?src-supplier=Element14; ComponentLink5Description: https://datasheet.ciiva.com/7746/1686128-7746280.pdf?src-supplier=Element14; ComponentLink6URL: https://datasheet.ciiva.com/28386/pyu-rc0603-51-rohs-l-4-28386648.pdf?src-supplier=Avnet+Europe; ComponentLink6Description: https://datasheet.ciiva.com/28386/pyu-rc0603-51-rohs-l-4-28386648.pdf?src-supplier=Avnet+Europe; ComponentLink7URL: https://datasheet.ciiva.com/7746/1738695-7746281.pdf?src-supplier=Element14; ComponentLink7Description: https://datasheet.ciiva.com/7746/1738695-7746281.pdf?src-supplier=Element14; ComponentLink8URL: https://datasheet.ciiva.com/8896/pyu-rc0603-51-rohs-l-4-8896106.pdf?src-supplier=Avnet; ComponentLink8Description: https://datasheet.ciiva.com/8896/pyu-rc0603-51-rohs-l-4-8896106.pdf?src-supplier=Avnet; ComponentLink9URL: https://datasheet.ciiva.com/15189/getdatasheetpartid-404327-15189644.pdf?src-supplier=Verical; ComponentLink9Description: https://datasheet.ciiva.com/15189/getdatasheetpartid-404327-15189644.pdf?src-supplier=Verical; ComponentLink10URL: https://datasheet.ciiva.com/7983/443971-7983613.pdf?src-supplier=Element14; ComponentLink10Description: https://datasheet.ciiva.com/7983/443971-7983613.pdf?src-supplier=Element14; Category: Resistor
R110 R117 = RC0603FR-07100KL: 100K Ohm 1% 1/10W 0603; Manufacturer: Yageo; Resistance: 100kR; Temperature Coefficient: 100ppm/°C; Voltage Rating (DC): 50V; Power Rating: 100mW; Working Voltage: 75V; Supplier 1: Digi-Key; Supplier Part Number 1: 311-100KHRCT-ND; Manufacturer Part Number: RC0603FR-07100KL; Stock 1: 10054915; Pricing 1: 1 = 0,10000, 10 = 0,02100, 100 = 0,00840, 1000 = 0,00379, 2500 = 0,00329 (USD); RoHS: Yes; Case/Package: 0603; Number of Pins: 2; Case Code (Imperial): 0603; Case Code (Metric): 1608; Min Operating Temperature: -55°C; Max Operating Temperature: 155°C; Tolerance: 1%; Packaging: Tape and Reel; Resistor Type: Thick Film; Voltage Rating: 50V; Termination: SMD/SMT; Number of Terminations: 2; Length: 1.6mm; Width: 0.8mm; Height: 0.45mm; Depth: 0.8mm; REACH SVHC: No SVHC; Lead Free: Lead Free; Military Standard: Not; ComponentLink1URL: https://datasheet.ciiva.com/11808/0900766b80f96399-11808107.pdf?src-supplier=RSComponents; ComponentLink1Description: https://datasheet.ciiva.com/11808/0900766b80f96399-11808107.pdf?src-supplier=RSComponents; ComponentLink2URL: https://datasheet.ciiva.com/7983/443971-7983593.pdf?src-supplier=Element14; ComponentLink2Description: https://datasheet.ciiva.com/7983/443971-7983593.pdf?src-supplier=Element14; ComponentLink3URL: https://datasheet.ciiva.com/46440/1868787-46440889.pdf?src-supplier=Element14; ComponentLink3Description: https://datasheet.ciiva.com/46440/1868787-46440889.pdf?src-supplier=Element14; ComponentLink4URL: https://datasheet.ciiva.com/7746/1738695-7746234.pdf?src-supplier=Element14; ComponentLink4Description: https://datasheet.ciiva.com/7746/1738695-7746234.pdf?src-supplier=Element14; ComponentLink5URL: https://datasheet.ciiva.com/7746/1738695-7746235.pdf?src-supplier=Element14; ComponentLink5Description: https://datasheet.ciiva.com/7746/1738695-7746235.pdf?src-supplier=Element14; ComponentLink6URL: https://datasheet.ciiva.com/22747/443971-22747516.pdf?src-supplier=Element14; ComponentLink6Description: https://datasheet.ciiva.com/22747/443971-22747516.pdf?src-supplier=Element14; Category: Resistor
R111 R118 = RC0603FR-0712KL: 12 kohm, 0603, 75 V, 1/10 W; Manufacturer: Yageo; Resistance: 12kR; Tolerance: 1%; Power Rating: 100mW; Voltage Rating (DC): 50V; Temperature Coefficient: 100ppm/°C; Supplier 1: Digi-Key; Supplier Part Number 1: 311-12.0KHRCT-ND; Manufacturer Part Number: RC0603FR-0712KL; Stock 1: 979649; Pricing 1: 1 = 0,10000, 10 = 0,02100, 100 = 0,00840, 1000 = 0,00379, 2500 = 0,00329 (USD); RoHS: Yes; Case/Package: 0603; Number of Pins: 2; Case Code (Imperial): 0603; Case Code (Metric): 1608; Min Operating Temperature: -55°C; Max Operating Temperature: 155°C; Packaging: Tape and Reel; Voltage Rating: 50V; Termination: SMD/SMT; Resistor Type: Thick Film; Package Quantity: 1; Number of Terminations: 2; Max Power Dissipation: 100mW; Features: Moisture Resistant; Length: 0.063inch; Width: 0.031inch; Height: 0.022inch; Depth: 0.8mm; REACH SVHC: No SVHC; Lead Free: Lead Free; Military Standard: Not; Category: Resistor
R112-R115 R119-R122 = RT0603FRE0710KL: 10K OHM 1% 1/10W 0603; Manufacturer: Yageo; Resistance: 10kR; Power Rating: 100mW; Voltage Rating: 75V; Temperature Coefficient: 50ppm/°C; Supplier 1: Digi-Key; Supplier Part Number 1: YAG2321CT-ND; Manufacturer Part Number: RT0603FRE0710KL; Stock 1: 326134; Pricing 1: 1 = 0,10000, 10 = 0,05600, 100 = 0,02270, 1000 = 0,01020, 2500 = 0,00886 (USD); RoHS: Yes; Case/Package: 0603; Number of Pins: 2; Case Code (Metric): 1608; Case Code (Imperial): 0603; Contact Plating: Tin,Lead; Min Operating Temperature: -55°C; Max Operating Temperature: 125°C; Package Quantity: 5000; Packaging: Tape and Reel; Tolerance: 1%; Resistor Type: Thin Film; Number of Terminations: 2; Termination: SMD/SMT; Max Power Dissipation: 100mW; Voltage Rating (DC): 75V; Features: Moisture Resistant; Length: 0.063inch; Width: 0.031inch; Height: 0.022inch; Depth: 0.8mm; REACH SVHC: Unknown; Military Standard: Not; Lead Free: Lead Free; ComponentLink1URL: https://datasheet.ciiva.com/2559/pyu-rt-1-to-0-05-rohs-l-5-2559482.pdf?src-supplier=Digi-Key; ComponentLink1Description: https://datasheet.ciiva.com/2559/pyu-rt-1-to-0-05-rohs-l-5-2559482.pdf?src-supplier=Digi-Key; ComponentLink2URL: https://datasheet.ciiva.com/16745/pyu-rt-1-to-0-05-rohs-l-4-16745739.pdf?src-supplier=Future+Electronics; ComponentLink2Description: https://datasheet.ciiva.com/16745/pyu-rt-1-to-0-05-rohs-l-4-16745739.pdf?src-supplier=Future+Electronics; ComponentLink3URL: https://datasheet.ciiva.com/12694/pyu-rt-1-to-0-05-rohs-l-4-12694910.pdf?src-supplier=Mouser; ComponentLink3Description: https://datasheet.ciiva.com/12694/pyu-rt-1-to-0-05-rohs-l-4-12694910.pdf?src-supplier=Mouser; Category: Resistor
XTAL3 XTAL4 = ABLS2-12.000MHZ-D4Y-T: 12MHZ, 18PF, HC-49US; Manufacturer: Abracon; Frequency Stability: 30ppm; Series Resistance: 50R; Supplier 1: Digi-Key; Supplier Part Number 1: 535-9869-1-ND; Manufacturer Part Number: ABLS2-12.000MHZ-D4Y-T; Stock 1: 149858; Pricing 1: 1 = 0,40000, 10 = 0,33600, 50 = 0,30240, 100 = 0,26880, 500 = 0,25536 (USD); RoHS: Yes; Mount: Surface Mount; Number of Pins: 2; Min Operating Temperature: -40°C; Max Operating Temperature: 85°C; Termination: SMD/SMT; ESR (Equivalent Series Resistance): 50R; Frequency: 12MHz; Load Capacitance: 18pF; Package Quantity: 1000; Tolerance: 30ppm; Packaging: Tape and Reel; Frequency Tolerance: 30ppm; Length: 11.4mm; Width: 4.7mm; Height: 0.13inch; Depth: 4.7mm; REACH SVHC: Unknown; Lead Free: Lead Free; ComponentLink1URL: https://datasheet.ciiva.com/15116/getdatasheetpartid-719896-15116779.pdf?src-supplier=Verical; ComponentLink1Description: https://datasheet.ciiva.com/15116/getdatasheetpartid-719896-15116779.pdf?src-supplier=Verical; ComponentLink2URL: https://datasheet.ciiva.com/16208/abls2-16208630.pdf?src-supplier=Future+Electronics; ComponentLink2Description: https://datasheet.ciiva.com/16208/abls2-16208630.pdf?src-supplier=Future+Electronics; ComponentLink3URL: https://datasheet.ciiva.com/854/abls2-854393.pdf?src-supplier=Digi-Key; ComponentLink3Description: https://datasheet.ciiva.com/854/abls2-854393.pdf?src-supplier=Digi-Key; ComponentLink4URL: https://datasheet.ciiva.com/854/abls2-854394.pdf?src-supplier=Digi-Key; ComponentLink4Description: https://datasheet.ciiva.com/854/abls2-854394.pdf?src-supplier=Digi-Key; ComponentLink5URL: https://datasheet.ciiva.com/3175/abls2-3175498.pdf?src-supplier=Avnet; ComponentLink5Description: https://datasheet.ciiva.com/3175/abls2-3175498.pdf?src-supplier=Avnet; ComponentLink6URL: https://datasheet.ciiva.com/854/abls2-854395.pdf?src-supplier=Digi-Key; ComponentLink6Description: https://datasheet.ciiva.com/854/abls2-854395.pdf?src-supplier=Digi-Key; ComponentLink7URL: https://datasheet.ciiva.com/7998/abls2-7998445.pdf?src-supplier=Element14; ComponentLink7Description: https://datasheet.ciiva.com/7998/abls2-7998445.pdf?src-supplier=Element14; Category: Crystals